# Altium schematic sheet PAGE1.schdoc: Active Tag 916 Transmitter/Processor
size B; DocumentNumber: Credit Card Size Tag; Revision: 37; SheetNumber: 1; SheetTotal: 2
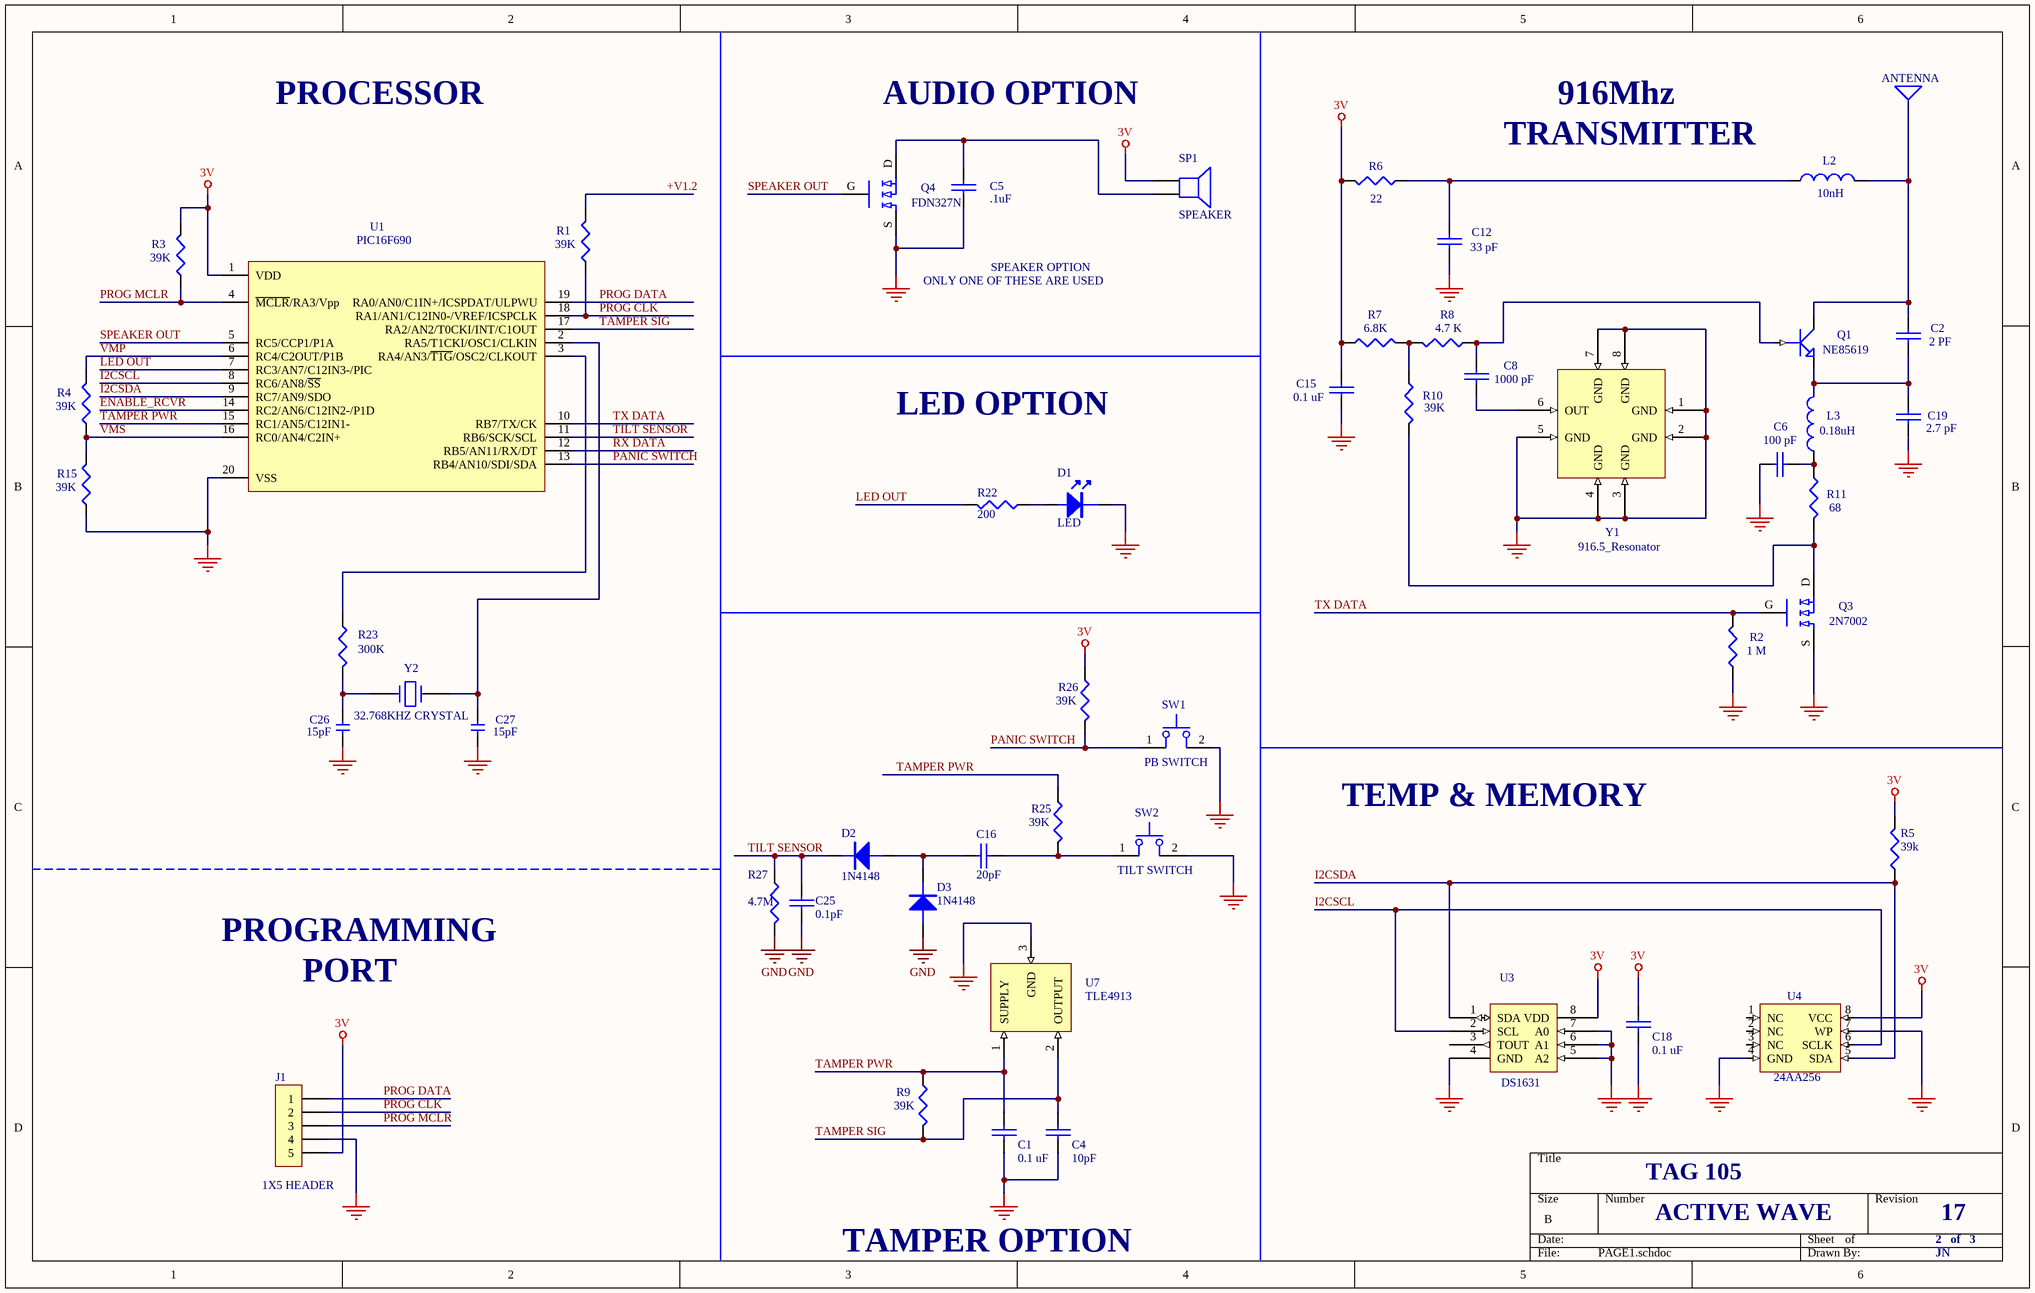
[diagram p0: PAGE1.schdoc]

## Parts
C1  0.1 uF  [0603]
C2  2 PF  [0603]
C4  10pF  [0603]
C5  .1uF  [0603]
C6  100 pF  [0603]
C8  1000 pF  [0603]
C12  33 pF  [0603]
C15  0.1 uF  [0603]
C16  20pF  [0603]
C18  0.1 uF  [0603]
C19  2.7 pF  [0603]
C25  0.1pF  [0603]
C26  15pF  [0603]
C27  15pF  [0603]
D1  LED  [LED STANLEY H_1105W]
D2  1N4148  [sod123_021405]
D3  1N4148  [sod123_021405]
J1  1X5 HEADER  [1X5 HEADER]
L2  10nH  [0603]
L3  0.18uH  [0603]
Q1  NE85619  [3 PIN ULTRA SUPER MINI MOLD]
Q3  2N7002
Q4  FDN327N
R1  39K  [0603]
R2  1 M  [0603]
R3  39K  [0603]
R4  39K  [0603]
R5  39k  [0603]
R6  22  [0603]
R7  6.8K  [0603]
R8  4.7 K  [0603]
R9  39K  [0603]
R10  39K  [0603]
R11  68  [0603]
R15  39K  [0603]
R22  200  [0603]
R23  300K  [0603]
R25  39K  [0603]
R26  39K  [0603]
R27  4.7M  [0603]
SP1  SPEAKER  [SMT_1028-S-R]
SW1  PB SWITCH  [SWITCH PB REVERSED_082907]
SW2  TILT SWITCH  [SQ-SEN-200]
U1  PIC16F690
U3  DS1631  [SO8 SMALL]
U4  24AA256  [SO8]
U7  TLE4913  [SOT23W]
Y1  916.5_Resonator  [RESONATOR]
Y2  32.768KHZ CRYSTAL  [CRYSTAL ABRACON ABS07]

## Nets
3V: C15.1 C18.1 J1.5 R3.2 R5.2 R6.2 R7.1 R26.1 SP1.1 U1.1(VDD) U3.8(VDD) U4.8(VCC)
GND: C1.2 C4.2 C5.2 C6.1 C12.2 C15.2 C18.2 C19.2 C25.2 C26.1 C27.1 D1.K D3.A J1.4 Q3.S Q4.S R2.1 R15.1 R27.2 SW1.2 SW2.2 U1.20(VSS) U3.4(GND) U3.5(A2) U3.6(A1) U3.7(A0) U4.4(GND) U4.7(WP) U7.3(GND) Y1.1(GND) Y1.2(GND) Y1.3(GND) Y1.4(GND) Y1.5(GND) Y1.7(GND) Y1.8(GND)
+V1.2: R1.2
ENABLE_RCVR: U1.14(RC2/AN6/C12IN2-/P1D)
I2CSCL: U1.8(RC6/AN8/~{SS}) U3.2(SCL) U4.6(SCLK)
I2CSDA: R5.1 U1.9(RC7/AN9/SDO) U3.1(SDA) U4.5(SDA)
LED OUT: R22.2 U1.7(RC3/AN7/C12IN3-/PIC)
PANIC SWITCH: R26.2 SW1.1 U1.13(RB4/AN10/SDI/SDA)
PROG CLK: J1.2 R1.1 U1.18(RA1/AN1/C12IN0-/VREF/ICSPCLK)
PROG DATA: J1.1 U1.19(RA0/AN0/C1IN+/ICSPDAT/ULPWU)
PROG MCLR: J1.3 R3.1 U1.4(~{MCLR}/RA3/Vpp)
RX DATA: U1.12(RB5/AN11/RX/DT)
SPEAKER OUT: Q4.G U1.5(RC5/CCP1/P1A)
TAMPER PWR: C1.1 R9.1 R25.1 U1.15(RC1/AN5/C12IN1-) U7.1(SUPPLY)
TAMPER SIG: C4.1 R9.2 U1.17(RA2/AN2/T0CKI/INT/C1OUT) U7.2(OUTPUT)
TILT SENSOR: C25.1 D2.K R27.1 U1.11(RB6/SCK/SCL)
TX DATA: Q3.G R2.2 U1.10(RB7/TX/CK)
VMP: R4.2 U1.6(RC4/C2OUT/P1B)
VMS: R4.1 R15.2 U1.16(RC0/AN4/C2IN+)
NetC2_1: C2.1 L2.2 Q1.C
NetC2_2: C2.2 C19.1 L3.2 Q1.E
NetC5_1: C5.1 Q4.D SP1.2
NetC6_2: C6.2 L3.1 R11.1
NetC8_1: C8.1 Q1.B R8.1
NetC8_2: C8.2 Y1.6(OUT)
NetC12_1: C12.1 L2.1 R6.1
NetC16_1: C16.1 D2.A D3.K
NetC16_2: C16.2 R25.2 SW2.1
NetC26_2: C26.2 R23.2 Y2.2
NetC27_2: C27.2 U1.2(RA5/T1CKI/OSC1/CLKIN) Y2.1
NetD1_A: D1.A R22.1
NetQ3_D: Q3.D R10.2 R11.2
NetR7_2: R7.2 R8.2 R10.1
NetR23_1: R23.1 U1.3(RA4/AN3/~{T1G}/OSC2/CLKOUT)

Not connected (* = marked no-connect by the designer): U3 3(TOUT); U4 1(NC) 2(NC) 3(NC)

## Notes on the sheet
- ANTENNA
- PROCESSOR
- AUDIO OPTION
- TRANSMITTER
- 916Mhz
- ONLY ONE OF THESE ARE USED
- SPEAKER OPTION
- LED OPTION
- TEMP & MEMORY
- PROGRAMMING
- PORT
- TAG 105
- ACTIVE WAVE
- 2   of   3
- 17
- TAMPER OPTION
- JN

## Library data of the parts
C1 C2 C4-C6 C8 C12 C15 C16 C18 C19 C25 = CAP: Capacitor
C26 C27 = C: Text Field1: 10; Text Field2: 20
D2 D3 = DIODE
J1 = CON5: Connector
L2 L3 = INDUCTOR: Text Field1: 20; Text Field2: 40
Q1 = NPN1: NPN Transistor
Q3 Q4 = FET 2
R1-R10 R15 R23 R25-R27 = RESISTOR: Text Field1: 20; Text Field2: 30
R11 R22 = RES1
SW1 SW2 = SWITCH PB
U3 = DS1631: Text Field1: 50; Text Field2: 50
U7 = HALL EFFECT SWITCH
Y1 = RESONATOR
Y2 = CRYSTAL